# Altium schematic sheet 3-Connectors.SchDoc
size A4; Author: Fabian Castaño; CompanyName: GIBIC Tech-Hub; Engineer: Fabian Castaño; Organization: Universidad de Antioquia; Address1: UdeA; Address2: Medellín; Address3: Antioquia; Address4: Colombia 050010; DocumentNumber: 4; SheetNumber: 4; SheetTotal: 4
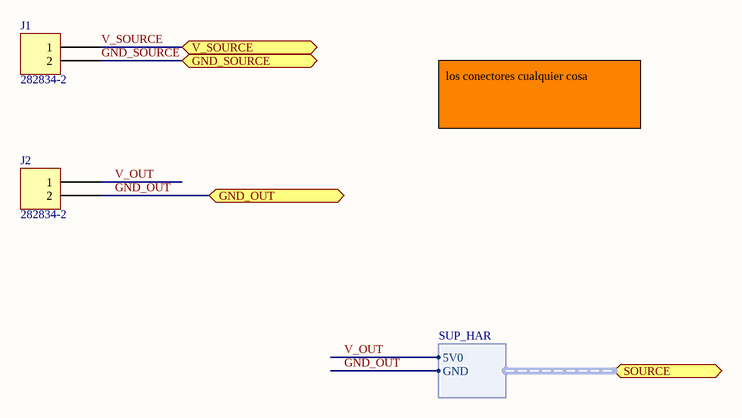
[diagram p0: 3-Connectors.SchDoc]

## Parts
J1  282834-2  [TE 282834-2]
J2  282834-2  [TE 282834-2]

## Ports
GND_OUT, GND_SOURCE, SOURCE (harness SUP_HAR), V_SOURCE

## Harnesses
SUP_HAR: 5V0, GND

## Nets
GND_OUT: J2.2 ; port GND_OUT, port SOURCE.GND
GND_SOURCE: J1.2 ; port GND_SOURCE
V_OUT: J2.1 ; port SOURCE.5V0
V_SOURCE: J1.1 ; port V_SOURCE

## Notes on the sheet
- los conectores cualquier cosa
- Notes
- Title
- Size:
- Date:
- A4
- Number:
- Time:
- Revision:
- Sheet
- of
- File:

## Library data of the parts
J1 J2 = 282834-2: TERM BLK 2P SIDE ENT 2.54MM PCB; Manufacturer: TE Connectivity AMP Connectors; Current: 10A; Mating Orientation: Horizontal with Board; Number of Levels: 1; Pitch: 0.100" (2.54mm); Positions Per Level: 2; Voltage: 150V; Wire Gauge: 16-30 AWG; Wire Termination: Screw - Rising Cage Clamp; Part Number: 282834-2; Color: Green; ComponentLink1Description: Datasheet; ComponentLink1URL: https://www.te.com/commerce/DocumentDelivery/DDEController?Action=srchrtrv&DocNm=282834&DocType=Customer+Drawing&DocLang=English; ComponentLink2Description: DigiKey Link; ComponentLink2URL: http://digikey.com/product-detail/en/te-connectivity-amp-connectors/282834-2/A98333-ND/1150135; LastUpdated: 15/01/2020 04:15:38; Lifecycle Status: Active; Minimum Order: 1; Mounting Type: Through Hole; Packaging: Bulk; Part Status: Active; Price: 0.88; Series: Buchanan; Supplier 1: DigiKey; Supplier Part Number 1: A98333-ND